# EAGLE design VEML6070-Breakout_v11 (EAGLE 7.5.0)
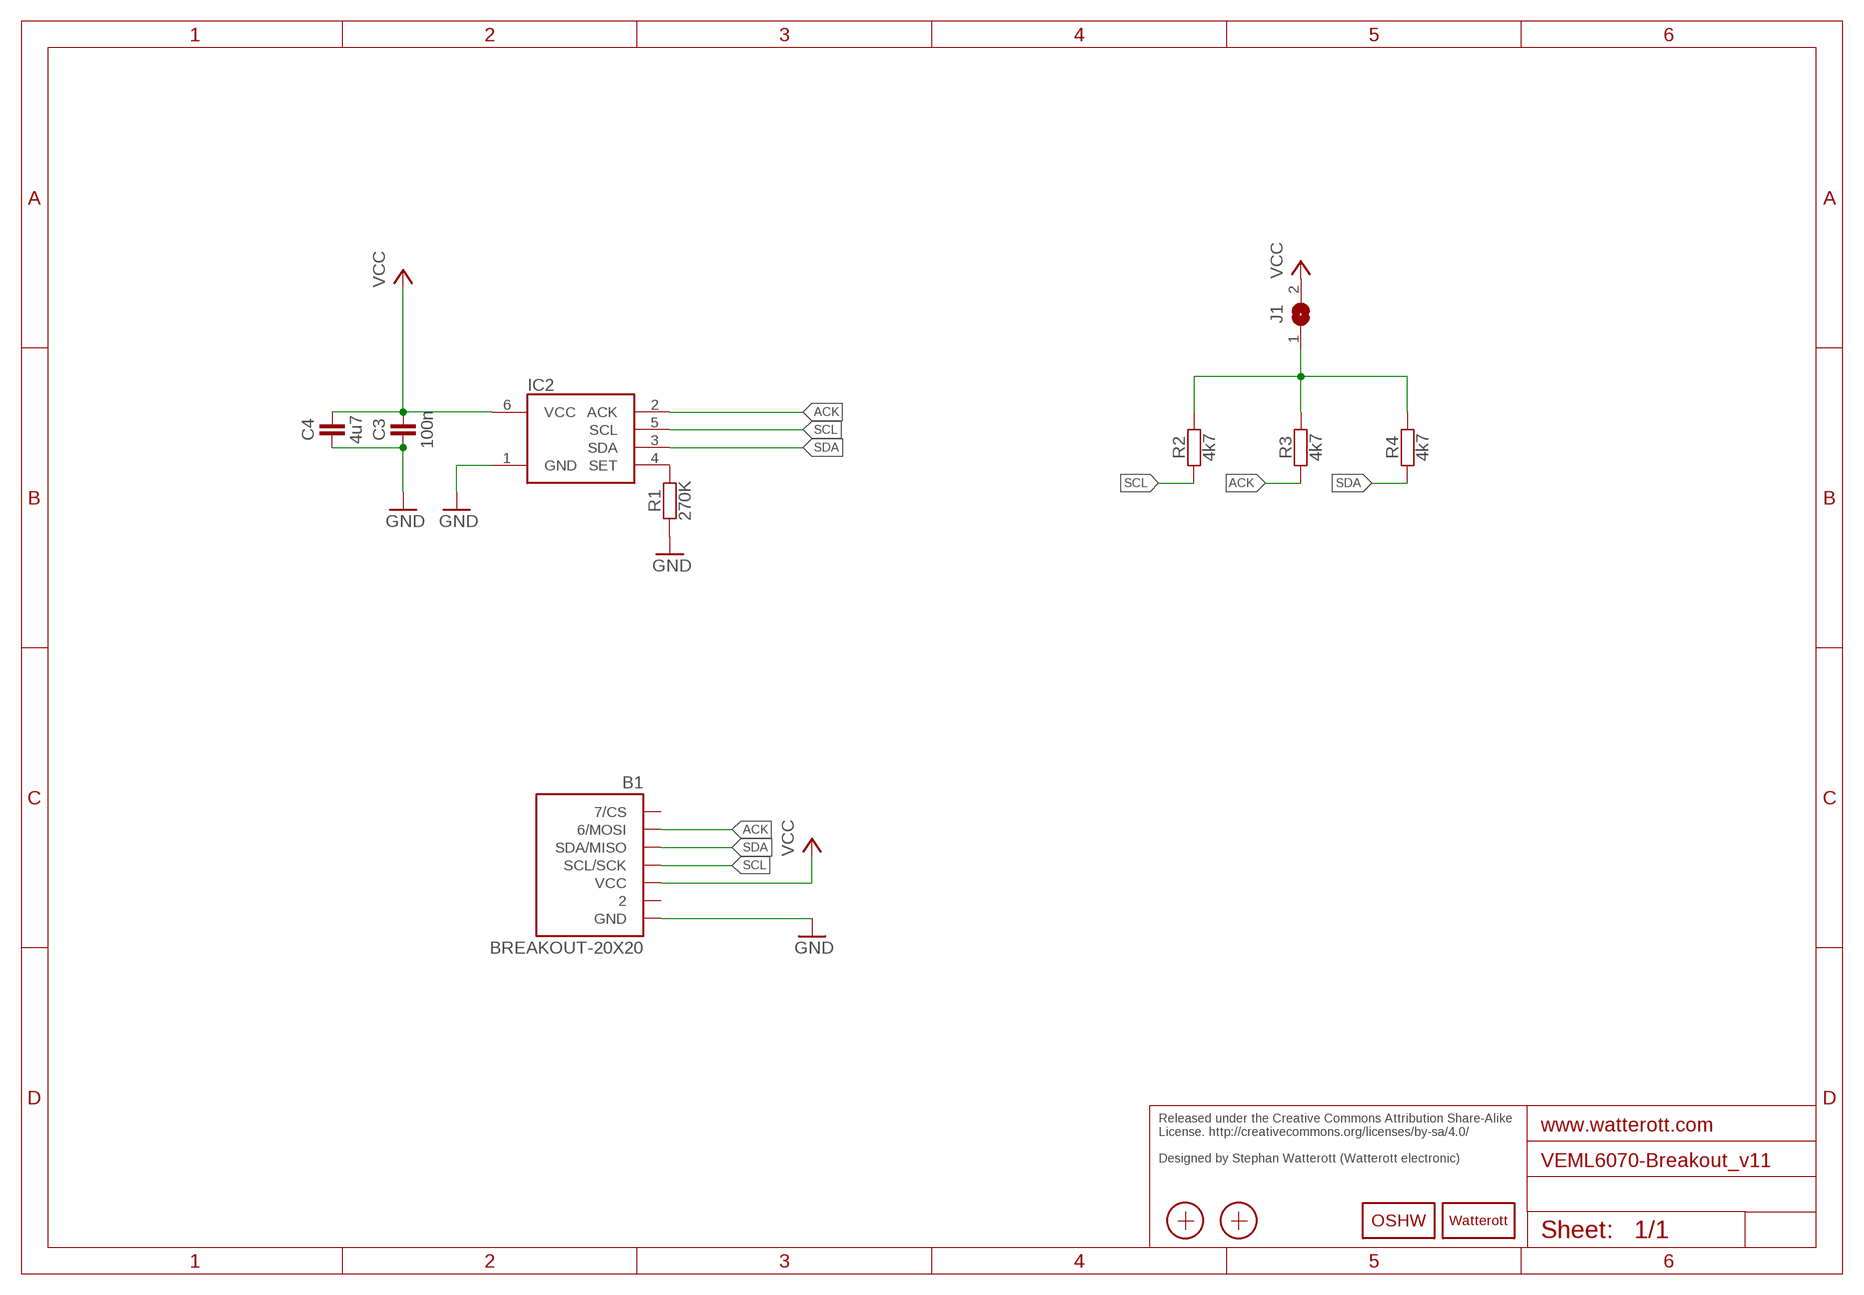
[diagram p0: schematic, sheet 1]

## Parts
B1  BREAKOUT-20X20  [BREAKOUT-20X20]
C3  100n  CAPACITOR-C0402  [R0402]
C4  4u7  CAPACITOR-C0402  [R0402]
IC2  VEML6070  [OPLGA]
J1  JUMPER2-0603-NC  [JUMPER2-0603_NC]
LOGO1  LOGO-S_PLACE_M  [SPARK_TPLACE_M]
LOGO2  OSHW_LOGOX0070  [OSHW_6X70]
R1  270K  RESISTOR-R0402  [R0402]
R2  4k7  RESISTOR-R0402  [R0402]
R3  4k7  RESISTOR-R0402  [R0402]
R4  4k7  RESISTOR-R0402  [R0402]
X1  PASSER-07  [PASSER_07MM]
X2  PASSER-07  [PASSER_07MM]

## Nets
ACK: B1.MOSI(6/MOSI) IC2.2(ACK) R3.1
GND: B1.GND C3.1 C4.1 IC2.1(GND) R1.1
N$1: IC2.4(SET) R1.2
N$2: J1.1 R2.2 R3.2 R4.2
SCL: B1.SCL/SCK IC2.5(SCL) R2.1
SDA: B1.SDA/MISO IC2.3(SDA) R4.1
VCC: B1.VCC C3.2 C4.2 IC2.6(VCC) J1.2
Unconnected: B1.2 B1.CS(7/CS)

## Notes on the sheet
- Released under the Creative Commons Attribution Share-Alike 
  License. http://creativecommons.org/licenses/by-sa/4.0/
  
  Designed by Stephan Watterott (Watterott electronic)

## Library data of the parts
B1 = we-board:BREAKOUT: Breakout Template
C3 C4 = we-rcl:CAPACITOR: Capacitors ...4.7uF @ 6.3V -> 0402 ...10uF @ 16V -> 0603 ...22uF @ 25V -> 0805
IC2 = we-sensor:VEML6070: UV Light Sensor with I2C Interface - VEML6070 is an advanced ultraviolet (UV) light sensor with I2C protocol interface and designed by the CMOS process.
J1 = we-rcl:JUMPER2: 2 Pin Jumpers
LOGO1 = we-symbol:LOGO: Watterott electronic Logo
LOGO2 = we-symbol:OSHW_LOGO: Open-Source-Hardware Logo
R1-R4 = we-rcl:RESISTOR: Resistors all kinds in 0603 and 0402
X1 X2 = we-symbol:PASSER: Fiducial Markers

## Board
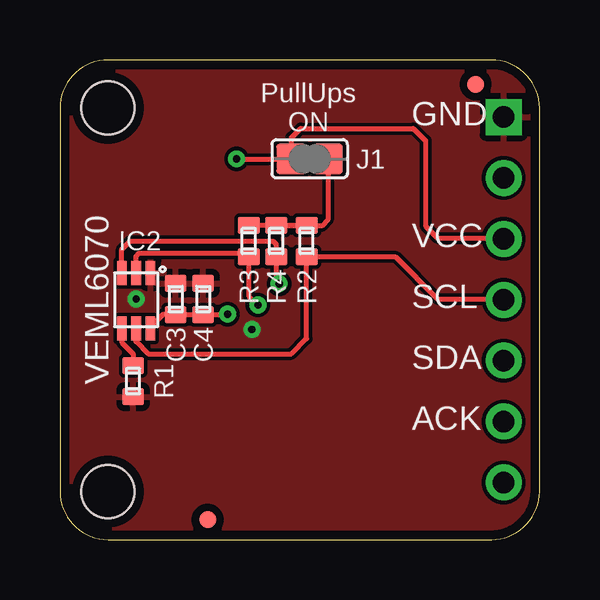
[diagram p1: board, top side]
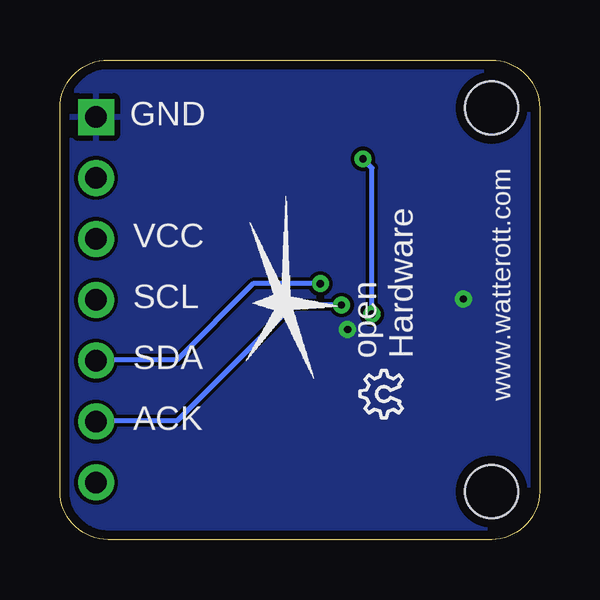
[diagram p2: board, bottom side, seen from below]

Size 20 x 20 mm. Coordinates in mm from the lower left corner, seen from the top.
Copper layers (1*16): Top 0.035mm / dielectric 1.5mm / Bottom 0.035mm
Design rules "default *": minimum track width 6mil, minimum drill 0.296mm, track to track 6mil, track to pad 6mil, pad to pad 6mil, via to via 6mil, smd to smd 1mil, copper to edge 15mil, drill to drill 8mil, minimum pad ring 10mil, minimum via ring 8mil, stop-mask expansion 4mil, vias tented up to drill 0.7mm, thermal gap 10mil

### Footprints (pad centres in the part's own frame; a part is rotated, then mirrored left to right if it is on the bottom)
BREAKOUT-20X20 = drill 0.9 pad 1.5: 2 18.5,15.08; CS 18.5,2.38; MOSI 18.5,4.92; SCL/SCK 18.5,10; SDA/MISO 18.5,7.46; VCC 18.5,12.54 | drill 0.9 pad 1.5 square: GND 18.5,17.62 | hole 2.2: 2,18; 2,2
R0402 = smd 0.9 x 0.7: 1 0,0.65; 2 0,-0.65
OPLGA = smd 1 x 0.4: 1 -1.12,0.6; 2 -1.12,0; 3 -1.12,-0.6; 4 1.2,-0.6; 5 1.2,0; 6 1.2,0.6
JUMPER2-0603_NC = smd 1.25 x 1.25: 1 0,0.76; 2 0,-0.76
PASSER_07MM = smd 0.7 x 0.7: X 0,0

### Placement (x,y rotation side)
B1  0,0 0 top
C3  4.83,10.03 0 top
C4  5.97,10.03 0 top
IC2  3.17,10 270 top
J1  10.41,15.88 270 top
LOGO1  10.67,9.91 90 bottom
LOGO2  5.71,5.08 90 bottom
R1  3.05,6.6 180 top
R2  10.29,12.45 180 top
R3  7.87,12.45 180 top
R4  9.02,12.45 180 top
X1  17.34,18.99 0 top
X2  6.16,0.83 0 top

### Tracks (layer width: path | path; a pad name or v marks a point on that pad's centre or on a via)
ACK  (via drill 0.3)
  Top 0.2: IC2.2 3.17,11.81 3.3,11.94 7.73,11.94 R3.1 7.87,10.16 v8.26,9.78
  Bottom 0.2: v8.26,9.78 10.29,9.78 15.11,4.95 18.47,4.95 B1.MOSI
GND  (via drill 0.3)
  other vias: 3.17,10.03 8,8.76
  pour Top: 0,20 20,20 20,0 0,0
  pour Bottom: 0,20 20,20 20,0 0,0
N$1
  Top 0.2: IC2.4 2.58,8.22 3.05,7.75 R1.2
N$2
  Top 0.2: R4.2 R2.2 | R2.2 R3.2 | J1.1 11.18,13.34 10.92,13.08 10.3,13.08 R2.2
SCL
  Top 0.2: IC2.5 3.17,8.26 3.68,7.75 9.65,7.75 10.29,8.38 R2.1 13.98,11.8 15.75,10.03 18.47,10.03 B1.SCL/SCK
SDA  (via drill 0.3)
  Top 0.2: IC2.3 2.58,12.1 2.92,12.45 8.89,12.45 9.02,12.32 R4.1 9.02,10.79 v9.14,10.67
  Bottom 0.2: v9.14,10.67 11.94,10.67 15.11,7.49 18.47,7.49 B1.SDA/MISO
VCC  (via drill 0.3)
  Top 0.2: IC2.6 3.77,8.86 4.32,9.4 4.81,9.4 C3.2 C4.2 6.97,9.38 v6.99,9.4 | v7.37,15.88 J1.2 9.65,16.77 10.03,17.14 14.73,17.14 15.24,16.64 15.24,13.08 15.75,12.57 18.47,12.57 B1.VCC
  Bottom 0.2: v6.99,9.4 6.99,15.49 v7.37,15.88

### Text on the board
tPlace: PullUps / ON | GND | VCC | VEML6070 | SCL | SDA | ACK
bPlace: GND | www.watterott.com | VCC | SCL | open / Hardware | SDA | ACK